# Altium schematic sheet do.SchDoc
size A2
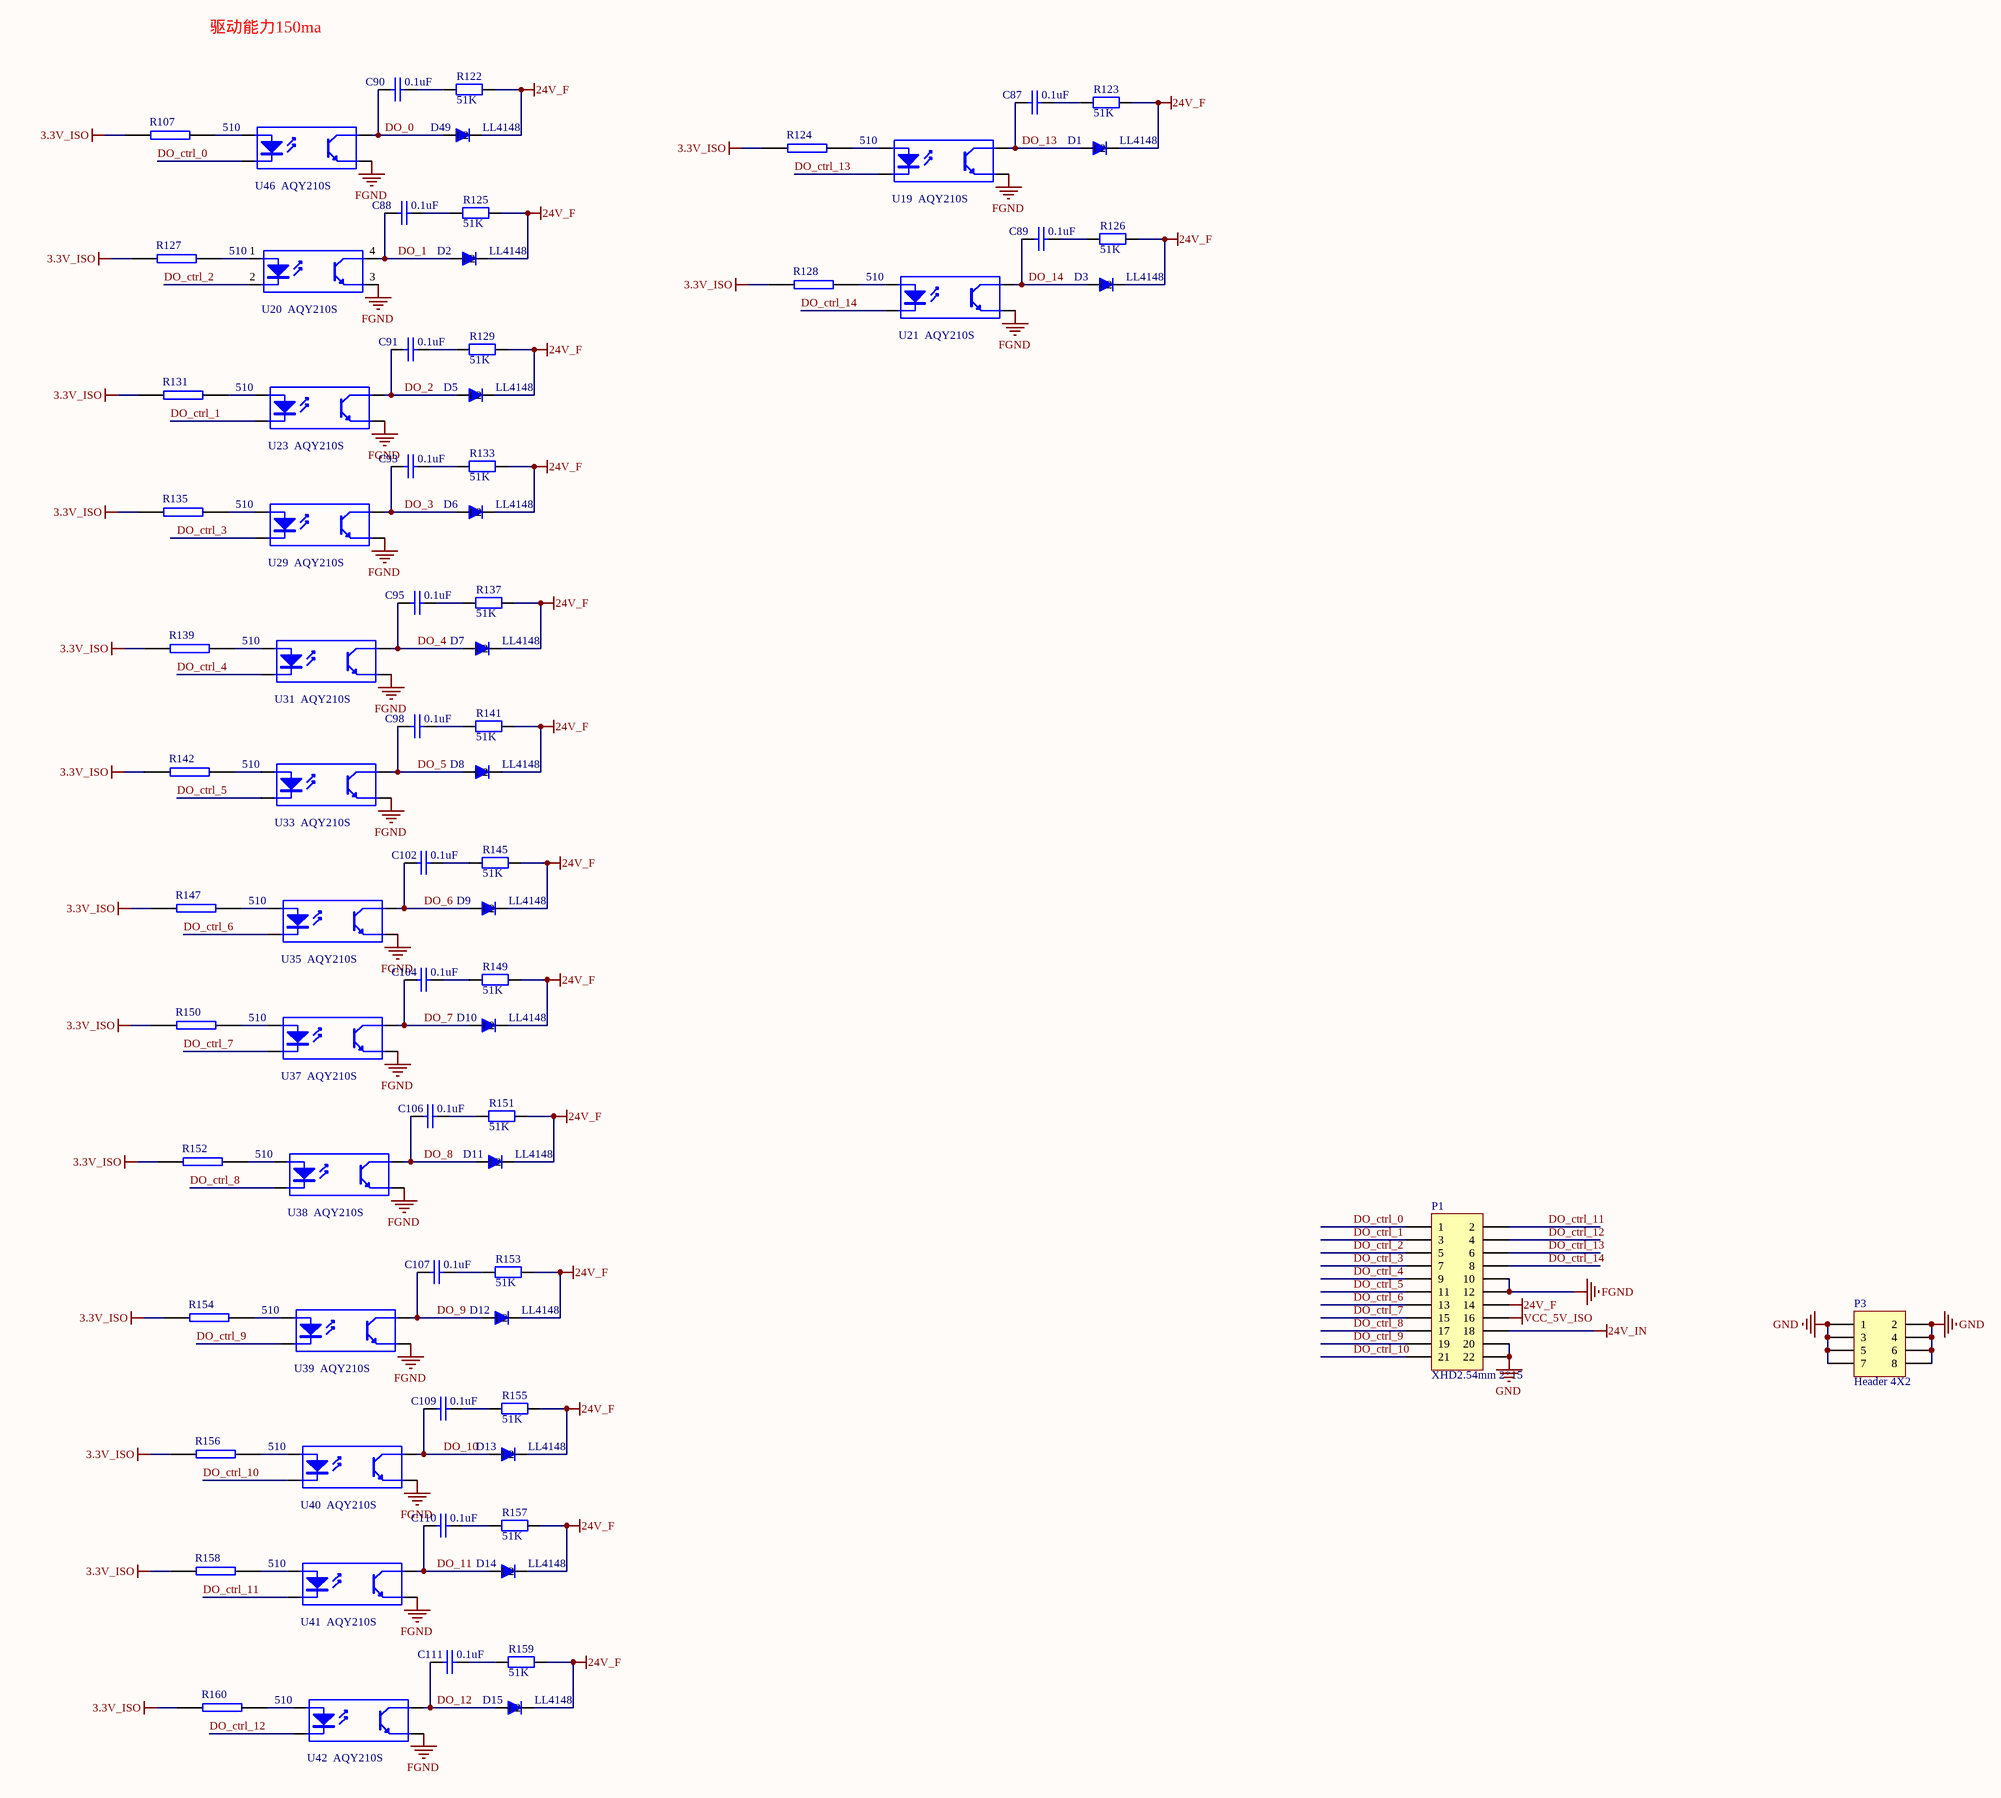
[diagram p0: do.SchDoc]

## Parts
C87  0.1uF  [0603C]
C88  0.1uF  [0603C]
C89  0.1uF  [0603C]
C90  0.1uF  [0603C]
C91  0.1uF  [0603C]
C93  0.1uF  [0603C]
C95  0.1uF  [0603C]
C98  0.1uF  [0603C]
C102  0.1uF  [0603C]
C104  0.1uF  [0603C]
C106  0.1uF  [0603C]
C107  0.1uF  [0603C]
C109  0.1uF  [0603C]
C110  0.1uF  [0603C]
C111  0.1uF  [0603C]
D1  LL4148  [DO-213AB/LL34/MiniMELF]
D2  LL4148  [DO-213AB/LL34/MiniMELF]
D3  LL4148  [DO-213AB/LL34/MiniMELF]
D5  LL4148  [DO-213AB/LL34/MiniMELF]
D6  LL4148  [DO-213AB/LL34/MiniMELF]
D7  LL4148  [DO-213AB/LL34/MiniMELF]
D8  LL4148  [DO-213AB/LL34/MiniMELF]
D9  LL4148  [DO-213AB/LL34/MiniMELF]
D10  LL4148  [DO-213AB/LL34/MiniMELF]
D11  LL4148  [DO-213AB/LL34/MiniMELF]
D12  LL4148  [DO-213AB/LL34/MiniMELF]
D13  LL4148  [DO-213AB/LL34/MiniMELF]
D14  LL4148  [DO-213AB/LL34/MiniMELF]
D15  LL4148  [DO-213AB/LL34/MiniMELF]
D49  LL4148  [DO-213AB/LL34/MiniMELF]
P1  XHD2.54mm 2*15  [HDR2X11]
P3  Header 4X2  [HDR2X4]
R107  510  [0603R]
R122  51K  [0603R]
R123  51K  [0603R]
R124  510  [0603R]
R125  51K  [0603R]
R126  51K  [0603R]
R127  510  [0603R]
R128  510  [0603R]
R129  51K  [0603R]
R131  510  [0603R]
R133  51K  [0603R]
R135  510  [0603R]
R137  51K  [0603R]
R139  510  [0603R]
R141  51K  [0603R]
R142  510  [0603R]
R145  51K  [0603R]
R147  510  [0603R]
R149  51K  [0603R]
R150  510  [0603R]
R151  51K  [0603R]
R152  510  [0603R]
R153  51K  [0603R]
R154  510  [0603R]
R155  51K  [0603R]
R156  510  [0603R]
R157  51K  [0603R]
R158  510  [0603R]
R159  51K  [0603R]
R160  510  [0603R]
U19  AQY210S  [sop4]
U20  AQY210S  [sop4]
U21  AQY210S  [sop4]
U23  AQY210S  [sop4]
U29  AQY210S  [sop4]
U31  AQY210S  [sop4]
U33  AQY210S  [sop4]
U35  AQY210S  [sop4]
U37  AQY210S  [sop4]
U38  AQY210S  [sop4]
U39  AQY210S  [sop4]
U40  AQY210S  [sop4]
U41  AQY210S  [sop4]
U42  AQY210S  [sop4]
U46  AQY210S  [sop4]

## Nets
3.3V_ISO: R107.2 R124.2 R127.2 R128.2 R131.2 R135.2 R139.2 R142.2 R147.2 R150.2 R152.2 R154.2 R156.2 R158.2 R160.2
24V_F: D1.2(1) D2.2(1) D3.2(1) D5.2(1) D6.2(1) D7.2(1) D8.2(1) D9.2(1) D10.2(1) D11.2(1) D12.2(1) D13.2(1) D14.2(1) D15.2(1) D49.2(1) P1.14 R122.2 R123.2 R125.2 R126.2 R129.2 R133.2 R137.2 R141.2 R145.2 R149.2 R151.2 R153.2 R155.2 R157.2 R159.2
24V_IN: P1.18
FGND: P1.10 P1.12 U19.3(E) U20.3(E) U21.3(E) U23.3(E) U29.3(E) U31.3(E) U33.3(E) U35.3(E) U37.3(E) U38.3(E) U39.3(E) U40.3(E) U41.3(E) U42.3(E) U46.3(E)
GND: P1.20 P1.22 P3.1 P3.2 P3.3 P3.4 P3.5 P3.6 P3.7 P3.8
VCC_5V_ISO: P1.16
DO_0: C90.1 D49.1(2) U46.4(C)
DO_1: C88.1 D2.1(2) U20.4(C)
DO_2: C91.1 D5.1(2) U23.4(C)
DO_3: C93.1 D6.1(2) U29.4(C)
DO_4: C95.1 D7.1(2) U31.4(C)
DO_5: C98.1 D8.1(2) U33.4(C)
DO_6: C102.1 D9.1(2) U35.4(C)
DO_7: C104.1 D10.1(2) U37.4(C)
DO_8: C106.1 D11.1(2) U38.4(C)
DO_9: C107.1 D12.1(2) U39.4(C)
DO_10: C109.1 D13.1(2) U40.4(C)
DO_11: C110.1 D14.1(2) U41.4(C)
DO_12: C111.1 D15.1(2) U42.4(C)
DO_13: C87.1 D1.1(2) U19.4(C)
DO_14: C89.1 D3.1(2) U21.4(C)
DO_ctrl_0: P1.1 U46.2(K)
DO_ctrl_1: P1.3 U23.2(K)
DO_ctrl_2: P1.5 U20.2(K)
DO_ctrl_3: P1.7 U29.2(K)
DO_ctrl_4: P1.9 U31.2(K)
DO_ctrl_5: P1.11 U33.2(K)
DO_ctrl_6: P1.13 U35.2(K)
DO_ctrl_7: P1.15 U37.2(K)
DO_ctrl_8: P1.17 U38.2(K)
DO_ctrl_9: P1.19 U39.2(K)
DO_ctrl_10: P1.21 U40.2(K)
DO_ctrl_11: P1.2 U41.2(K)
DO_ctrl_12: P1.4 U42.2(K)
DO_ctrl_13: P1.6 U19.2(K)
DO_ctrl_14: P1.8 U21.2(K)
NetC87_2: C87.2 R123.1
NetC88_2: C88.2 R125.1
NetC89_2: C89.2 R126.1
NetC90_2: C90.2 R122.1
NetC91_2: C91.2 R129.1
NetC93_2: C93.2 R133.1
NetC95_2: C95.2 R137.1
NetC98_2: C98.2 R141.1
NetC102_2: C102.2 R145.1
NetC104_2: C104.2 R149.1
NetC106_2: C106.2 R151.1
NetC107_2: C107.2 R153.1
NetC109_2: C109.2 R155.1
NetC110_2: C110.2 R157.1
NetC111_2: C111.2 R159.1
NetR107_1: R107.1 U46.1(A)
NetR124_1: R124.1 U19.1(A)
NetR127_1: R127.1 U20.1(A)
NetR128_1: R128.1 U21.1(A)
NetR131_1: R131.1 U23.1(A)
NetR135_1: R135.1 U29.1(A)
NetR139_1: R139.1 U31.1(A)
NetR142_1: R142.1 U33.1(A)
NetR147_1: R147.1 U35.1(A)
NetR150_1: R150.1 U37.1(A)
NetR152_1: R152.1 U38.1(A)
NetR154_1: R154.1 U39.1(A)
NetR156_1: R156.1 U40.1(A)
NetR158_1: R158.1 U41.1(A)
NetR160_1: R160.1 U42.1(A)

## Notes on the sheet
- 驱动能力150ma

## Library data of the parts
C87-C91 C93 C95 C98 C102 C104 C106 C107 C109-C111 = CAP: Capacitor
D1-D3 D5-D15 D49 = LL4148: VISHAY,LL4148,圆柱体MiniMELF100V/2A,ROHS; 版本: V1.00; 名称: 快速开关二极管; 物料编号: APLLY; 制造商: VISHAY
P1 = Header 11X2: Header, 11-Pin, Dual row; LatestRevisionDate: 17-Jul-2002; LatestRevisionNote: Re-released for DXP Platform.; Publisher: Altium Limited
P3 = Header 4X2: Header, 4-Pin, Dual row; LatestRevisionDate: 17-Jul-2002; LatestRevisionNote: Re-released for DXP Platform.; Publisher: Altium Limited
R107 R124 R127 R128 R131 R135 R139 R142 R147 R150 R152 R154 R156 R158 R160 = RES2
R122 R123 R125 R126 R129 R133 R137 R141 R145 R149 R151 R153 R155 R157 R159 = Res0805M
U19-U21 U23 U29 U31 U33 U35 U37-U42 U46 = Optoisolator1: 4-Pin Phototransistor Optocoupler; Published: 24-Mar-1999; LatestRevisionDate: 04-Mar-2005; LatestRevisionNote: Sch pins 3 & 4 Swapped.; DatasheetVersion: Nov-2003; PackageReference: DIP-4; Publisher: Altium Limited